# Altium schematic sheet Sensor Suite 1.SchDoc
size A4; SheetNumber: 4; SheetTotal: 6
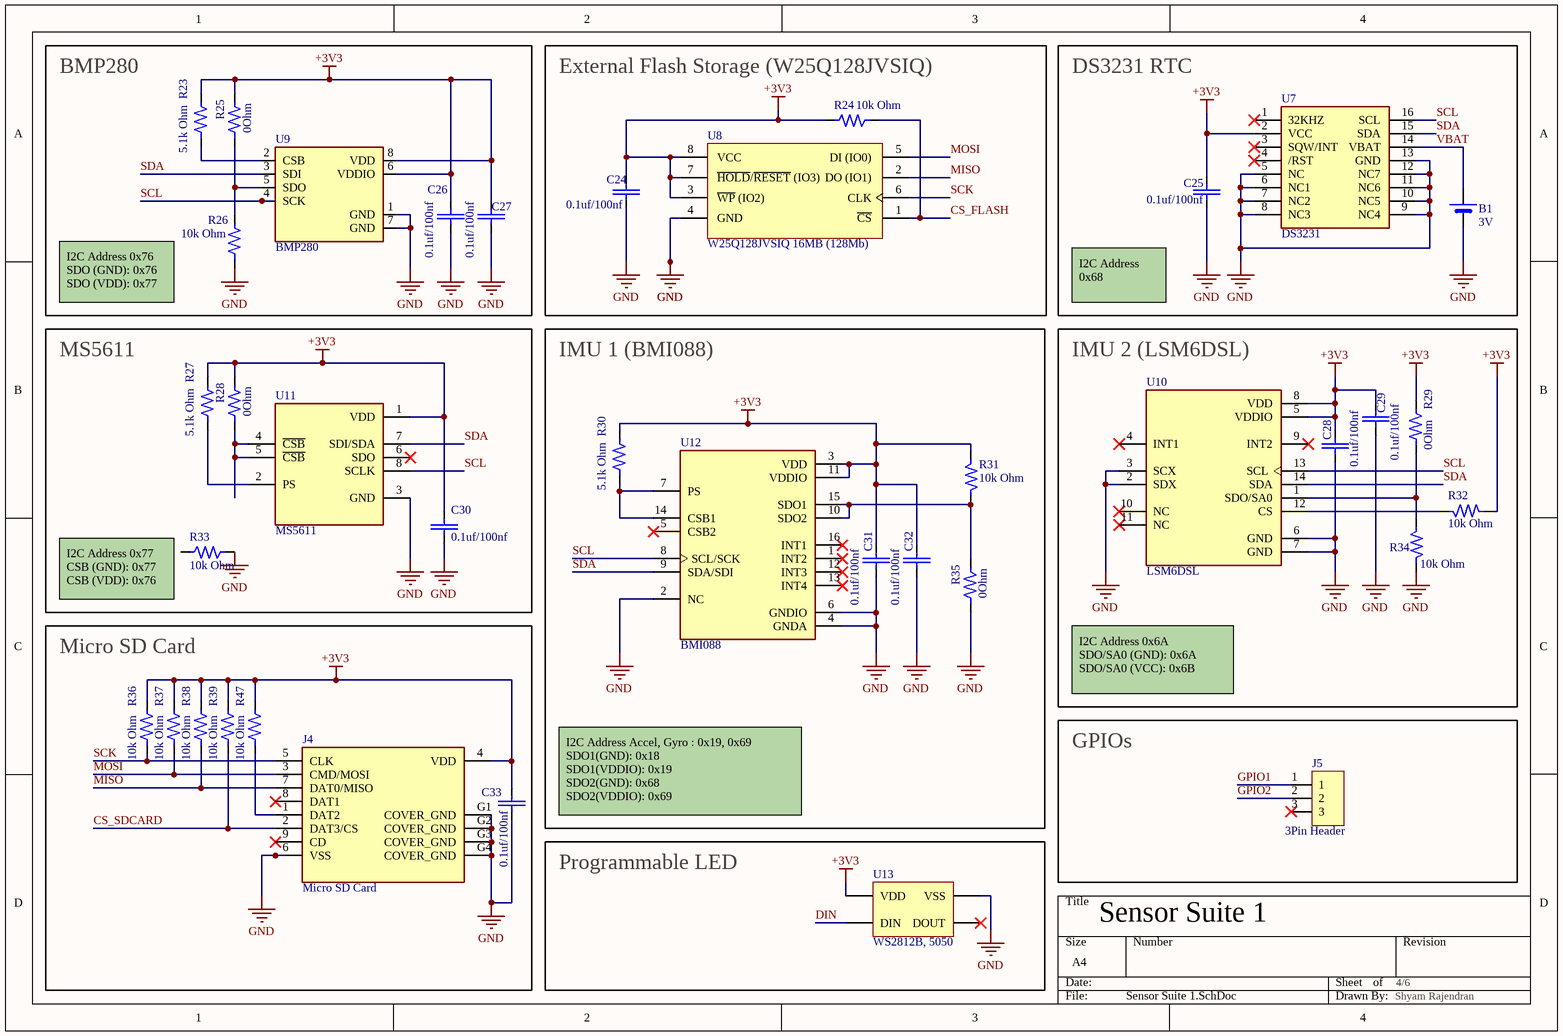
[diagram p0: Sensor Suite 1.SchDoc]

## Parts
B1  3V  [Battery Holder]
C24  0.1uf/100nf  [0.1uF Capacitor]
C25  0.1uf/100nf  [0.1uF Capacitor]
C26  0.1uf/100nf  [0.1uF Capacitor]
C27  0.1uf/100nf  [0.1uF Capacitor]
C28  0.1uf/100nf  [0.1uF Capacitor]
C29  0.1uf/100nf  [0.1uF Capacitor]
C30  0.1uf/100nf  [0.1uF Capacitor]
C31  0.1uf/100nf  [0.1uF Capacitor]
C32  0.1uf/100nf  [0.1uF Capacitor]
C33  0.1uf/100nf  [0.1uF Capacitor]
J4  Micro SD Card  [Micro SD Card]
J5  3Pin Header  [3 Pin Header]
R23  5.1k Ohm  [RESC2012X60N]
R24  10k Ohm  [RESC2013X60X35ML10T20]
R25  0Ohm  [1k 0805 Resistor]
R26  10k Ohm  [RESC2013X60X35ML10T20]
R27  5.1k Ohm  [RESC2012X60N]
R28  0Ohm  [1k 0805 Resistor]
R29  0Ohm  [1k 0805 Resistor]
R30  5.1k Ohm  [RESC2012X60N]
R31  10k Ohm  [RESC2013X60X35ML10T20]
R32  10k Ohm  [RESC2013X60X35ML10T20]
R33  10k Ohm  [RESC2013X60X35ML10T20]
R34  10k Ohm  [RESC2013X60X35ML10T20]
R35  0Ohm  [1k 0805 Resistor]
R36  10k Ohm  [RESC2013X60X35ML10T20]
R37  10k Ohm  [RESC2013X60X35ML10T20]
R38  10k Ohm  [RESC2013X60X35ML10T20]
R39  10k Ohm  [RESC2013X60X35ML10T20]
R47  10k Ohm  [RESC2013X60X35ML10T20]
U7  DS3231 RTC  [DS3231]  (value not drawn)
U8  W25Q128JVSIQ 16MB (128Mb)  [W25Q128JVSIQ]
U9  BMP280  [BMP280]
U10  LSM6DSL  [LSM6DSO32TR]
U11  MS5611  [MS561101BA03-50]
U12  BMI088  [BMI088]
U13  WS2812B, 5050  [WS2812B]

## Blocks framed on the sheet
BMP280: C26 C27 R23 R25 R26 U9
External Flash Storage (W25Q128JVSIQ): C24 R24 U8
DS3231 RTC: B1 C25 U7
MS5611: C30 R27 R28 R33 U11
IMU 1 (BMI088): C31 C32 R30 R31 R35 U12
IMU 2 (LSM6DSL): C28 C29 R29 R32 R34 U10
Micro SD Card: C33 J4 R36-R39 R47
GPIOs: J5
Programmable LED: U13

## Nets
+3V3: C24.1 C25.1 C26.2 C27.2 C28.2 C29.2 C30.2 C31.2 C32.2 C33.2 J4.4(VDD) R23.2 R24.2 R25.2 R27.2 R28.2 R29.2 R30.2 R31.2 R32.1 R36.2 R37.2 R38.2 R39.2 R47.2 U7.2(VCC) U8.3(~{WP}_(IO2)) U8.7(~{HOLD}/~{RESET}_(IO3)) U8.8(VCC) U9.6(VDDIO) U9.8(VDD) U10.5(VDDIO) U10.8(VDD) U11.1(VDD) U12.3(VDD) U12.11(VDDIO) U13.VDD
GND: B1.N C24.2 C25.2 C26.1 C27.1 C28.1 C29.1 C30.1 C31.1 C32.1 C33.1 J4.6(VSS) J4.G1(COVER_GND) J4.G2(COVER_GND) J4.G3(COVER_GND) J4.G4(COVER_GND) R26.1 R33.1 R34.1 R35.1 U7.5(NC) U7.6(NC1) U7.7(NC2) U7.8(NC3) U7.9(NC4) U7.10(NC5) U7.11(NC6) U7.12(NC7) U7.13(GND) U8.4(GND) U9.1(GND) U9.7(GND) U10.2(SDX) U10.3(SCX) U10.6(GND) U10.7(GND) U11.3(GND) U12.2(NC) U12.4(GNDA) U12.6(GNDIO) U13.VSS
CS_FLASH: R24.1 U8.1(~{CS})
CS_SDCARD: J4.2(DAT3/CS) R39.1
DIN: U13.DIN
GPIO1: J5.1
GPIO2: J5.2
MISO: J4.7(DAT0/MISO) R38.1 U8.2(DO_(IO1))
MOSI: J4.3(CMD/MOSI) R37.1 U8.5(DI_(IO0))
SCK: J4.5(CLK) R36.1 U8.6(CLK)
SCL: U7.16(SCL) U9.4(SCK) U10.13(SCL) U11.8(SCLK) U12.8(SCL/SCK)
SDA: U7.15(SDA) U9.3(SDI) U10.14(SDA) U11.7(SDI/SDA) U12.9(SDA/SDI)
VBAT: B1.P U7.14(VBAT)
NetJ4_1: J4.1(DAT2) R47.1
NetR23_1: R23.1 U9.2(CSB)
NetR25_1: R25.1 R26.2 U9.5(SDO)
NetR27_1: R27.1 U11.2(PS)
NetR28_1: R28.1 U11.4(~{CSB}) U11.5(~{CSB})
NetR29_1: R29.1 R34.2 U10.1(SDO/SA0)
NetR30_1: R30.1 U12.7(PS) U12.14(CSB1)
NetR31_1: R31.1 R35.2 U12.10(SDO2) U12.15(SDO1)
NetR32_2: R32.2 U10.12(CS)

Not connected (* = marked no-connect by the designer): J4 8(DAT1)* 9(CD)*; J5 3*; R33 2; U7 1(32KHZ)* 3(SQW/INT)* 4(/RST)*; U10 4(INT1)* 9(INT2)* 10(NC)* 11(NC)*; U11 6(SDO)*; U12 1(INT2)* 5(CSB2)* 12(INT3)* 13(INT4)* 16(INT1)*; U13 DOUT*

## Notes on the sheet
- I2C Address 0x76
  SDO (GND): 0x76
  SDO (VDD): 0x77
- I2C Address 0x68
- (near R33) I2C Address 0x77
  CSB (GND): 0x77
  CSB (VDD): 0x76
- I2C Address 0x6A
  SDO/SA0 (GND): 0x6A
  SDO/SA0 (VCC): 0x6B
- (near C33) I2C Address Accel, Gyro : 0x19, 0x69
  SDO1(GND): 0x18
  SDO1(VDDIO): 0x19
  SDO2(GND): 0x68
  SDO2(VDDIO): 0x69
- Sensor Suite 1 <BMP280>
- 4/6 <BMP280>
- Shyam Rajendran <BMP280>

## Library data of the parts
B1 = Button Cell: CR2032 Button Cell
C24-C33 = CC0805KRX7R9BB104: 0.1 uF, Multilayer Ceramic Capacitor, 50 V, ï¿½ 10%, X7R, 0805 [2012 Metric]; Manufacturer: Yageo; Value: 100nF; Voltage Rating: 50V; Insulation Resistance: 100GR; Supplier: Future Electronics; Supplier Part Number: 2986263; Manufacturer Part Number: CC0805KRX7R9BB104; RoHS: Yes; Category: Ceramic Capacitors; Stock: 2884000; Pricing: 4000=0.009, 12000=0.0088, 40000=0.0085, 80000=0.0083, 160000=0.008 (USD); Mounting Technology: Surface Mount; Case/Package: 0805; Pins: 2; Case Code (Metric): 2012; Case Code (Imperial): 0805; Material: Ceramic; Min Operating Temperature: -55°C; Max Operating Temperature: 125°C; Packaging: Tape and Reel; Tolerance: 10%; Dielectric: X7R; Series: CC; Package Quantity: 4000; Voltage: 50V; Termination: SMD/SMT; Length: 2mm; Height: 0.85mm; Depth: 1.25mm; Radiation Hardening: No; RoHS Compliant: Yes; Lead Free: 5697LeadFree; Reach SVHC Compliant: No; Halogen Free: 5694HalogenFree
J4 = Micro SD Card: Micro SD Card Connector, 9 Positions, Connector and Ejector, Push In, Auto Eject Out, Surface Mount, 1.8 mm Height Above Board, Gold Flash; MF: CUI Devices; MP: MSD-1-A; SnapEDA_Link: https://www.snapeda.com/parts/MSD-1-A/CUI+Devices/view-part/?ref=snap; Package: None; Value: *; CUI_purchase_URL: https://www.cuidevices.com/product/interconnect/connectors/memory-card-connectors/sd-card-connectors/msd-1-a?utm_source=snapeda.com&utm_medium=referral&utm_campaign=snapedaBOM; Check_prices: https://www.snapeda.com/parts/MSD-1-A/CUI+Devices/view-part/?ref=eda
J5 = Header 3pin
R23 R27 R30 = RC0805FR-075K1L: 5.1k Ohm, 0805, 0.125W, 150V, 1% +/-Tol, 100ppm/Cel, Surface Mount; Manufacturer: Yageo; Additional Feature: LASER TRIMMABLE; Power: 125mW; Rated Temperature: 70°C; Value: 5.1kR; Temperature Coefficient (ppm/Cel): 100; Package Height: 0.5mm; Package Length: 2mm; Package Width: 1.25mm; Supplier: Future Electronics; Supplier Part Number: 5647425; Manufacturer Part Number: RC0805FR-075K1L; RoHS: Yes; Category: Chip SMD Resistors; Stock: 15000; Pricing: 5000=0.0021, 20000=0.002, 100000=0.0019, 200000=0.0018, 625000=0.0017 (USD); Mounting Technology: Surface Mount; Pins: 2; Package Shape: Rectangular; Case/Package: 0805; Terminal Finish: Nickel; Min Operating Temperature: -55°C; Max Operating Temperature: 155°C; Tolerance: 1%; JESD-609 Code: e3; Termination: Wraparound; Resistor Type: FIXED RESISTOR; Construction: Chip; Packaging: Tape and Reel; Technology: METAL GLAZE/THICK FILM; Working Voltage: 150V; Reach SVHC Compliant: Yes; RoHS Compliant: Yes; ComponentLink1URL: https://datasheet.ciiva.com:443/pdfs/VipMasterIC/IC/YAGO/YAGO-S-A0008145938/YAGO-S-A0008145938-1.pdf?src-supplier=IHS+Markit; ComponentLink1Description: https://datasheet.ciiva.com:443/pdfs/VipMasterIC/IC/YAGO/YAGO-S-A0008145938/YAGO-S-A0008145938-1.pdf?src-supplier=IHS+Markit; ComponentLink2URL: https://datasheet.ciiva.com/11808/0900766b8106beab-11808171.pdf?src-supplier=Rs; ComponentLink2Description: https://datasheet.ciiva.com/11808/0900766b8106beab-11808171.pdf?src-supplier=Rs; ComponentLink3URL: https://datasheet.ciiva.com/2456/pyu-r-int-thick-7-2456979.pdf?src-supplier=Digikey; ComponentLink3Description: https://datasheet.ciiva.com/2456/pyu-r-int-thick-7-2456979.pdf?src-supplier=Digikey; ComponentLink4URL: https://datasheet.ciiva.com/2456/pyu-r-int-thick-7-2456980.pdf?src-supplier=Digikey; ComponentLink4Description: https://datasheet.ciiva.com/2456/pyu-r-int-thick-7-2456980.pdf?src-supplier=Digikey; ComponentLink5URL: https://datasheet.ciiva.com/15189/getdatasheetpartid-326574-15189996.pdf?src-supplier=Verical; ComponentLink5Description: https://datasheet.ciiva.com/15189/getdatasheetpartid-326574-15189996.pdf?src-supplier=Verical; ComponentLink6URL: https://datasheet.ciiva.com/2456/pyu-r-int-thick-7-2456978.pdf?src-supplier=Digikey; ComponentLink6Description: https://datasheet.ciiva.com/2456/pyu-r-int-thick-7-2456978.pdf?src-supplier=Digikey
R24 R26 R31-R34 R36-R39 R47 = RC0805FR-0710KL: 10 kOhm, SMD Chip Resistor, ï¿½ 1%, 125 mW, 0805 [2012 Metric], Thick Film, General Purpose; Manufacturer: Yageo; Value: 10kR; Power Rating: 125mW; Voltage Rating: 150V; Temperature Coefficient: 100ppm/°C; Supplier: Future Electronics; Supplier Part Number: 3310877; Manufacturer Part Number: RC0805FR-0710KL; RoHS: Yes; Category: Chip SMD Resistors; Stock: 15945000; Pricing: 5000=0.0021, 20000=0.002, 100000=0.0019, 200000=0.0018, 625000=0.0017 (USD); Case/Package: 0805; Case Code (Imperial): 0805; Case Code (Metric): 2012; Min Operating Temperature: -55°C; Max Operating Temperature: 155°C; Packaging: Tape and Reel; Tolerance: 1%; Termination: SMD/SMT; Number of Terminations: 2; Max Power Dissipation: 125mW; Features: Moisture Resistant; Series: RC; Resistor Type: Thick Film; Construction: Rectangular; Resistance Tolerance: 1%; Package Quantity: 1; Technology: THICK FILM; Voltage Rating (AC): 150V; Length: 0.079inch; Width: 0.049inch; Height: 0.024inch; Depth: 1.25mm; Lead Free: Lead Free; RoHS Compliant: Yes; Military Standard: Not; Reach SVHC Compliant: Unknown; ComponentLink1URL: https://datasheet.ciiva.com/11808/0900766b8106beab-11808151.pdf?src-supplier=Rs; ComponentLink1Description: https://datasheet.ciiva.com/11808/0900766b8106beab-11808151.pdf?src-supplier=Rs; ComponentLink2URL: https://datasheet.ciiva.com/46447/444164-46447563.pdf?src-supplier=Element14; ComponentLink2Description: https://datasheet.ciiva.com/46447/444164-46447563.pdf?src-supplier=Element14; ComponentLink3URL: https://datasheet.ciiva.com/2456/pyu-r-int-thick-7-2456973.pdf?src-supplier=Digikey; ComponentLink3Description: https://datasheet.ciiva.com/2456/pyu-r-int-thick-7-2456973.pdf?src-supplier=Digikey; ComponentLink4URL: https://datasheet.ciiva.com/2456/pyu-r-int-thick-7-2456974.pdf?src-supplier=Digikey; ComponentLink4Description: https://datasheet.ciiva.com/2456/pyu-r-int-thick-7-2456974.pdf?src-supplier=Digikey; ComponentLink5URL: https://datasheet.ciiva.com/2456/pyu-r-int-thick-7-2456972.pdf?src-supplier=Digikey; ComponentLink5Description: https://datasheet.ciiva.com/2456/pyu-r-int-thick-7-2456972.pdf?src-supplier=Digikey; ComponentLink6URL: https://datasheet.ciiva.com/12669/rc0805-12669688.pdf?src-supplier=Mouser; ComponentLink6Description: https://datasheet.ciiva.com/12669/rc0805-12669688.pdf?src-supplier=Mouser; ComponentLink7URL: https://datasheet.ciiva.com/16747/rc0805-16747087.pdf?src-supplier=Future+Electronics; ComponentLink7Description: https://datasheet.ciiva.com/16747/rc0805-16747087.pdf?src-supplier=Future+Electronics
R25 R28 R29 R35 = CRCW08050000Z0EA: 0 Ohm Resistor, Jumper, 0805 [2012 Metric], Thick Film, 125 mW, Surface Mount; Manufacturer: Vishay; Value: 0mR; Power Rating: 125mW; Temperature Coefficient: 100ppm/°C; Voltage Rating: 150V; Tolerance: 1%; Supplier: Arrow Electronics; Supplier Part Number: CRCW08050000Z0EA; Manufacturer Part Number: CRCW08050000Z0EA; RoHS: Yes; Category: Chip SMD Resistors; Stock: 1390000; Pricing: 5000=0.0051, 10000=0.005, 15000=0.0049, 25000=0.0045 (USD); Case/Package: 0805; Case Code (Imperial): 0805; Case Code (Metric): 2012; Contact Plating: Tin; Weight: 0.000194oz; Min Operating Temperature: -55°C; Max Operating Temperature: 155°C; Packaging: Tape and Reel; Series: CRCW; Number of Terminations: 2; Resistor Type: Thick Film; Termination: SMD/SMT; Max Power Dissipation: 125mW; Package Quantity: 1; Features: Automotive AEC-Q200; Construction: Rectangular; Technology: THICK FILM; Voltage Rating (DC): 150V; Resistance Tolerance: 1%; Length: 2mm; Width: 0.049inch; Height: 0.45mm; Depth: 1.25mm; Radiation Hardening: No; RoHS Compliant: Yes; Military Standard: Not; Reach SVHC Compliant: Unknown; Lead Free: 5697LeadFree; ComponentLink1URL: https://datasheet.ciiva.com/11811/0900766b80d98b26-11811304.pdf?src-supplier=Rs; ComponentLink1Description: https://datasheet.ciiva.com/11811/0900766b80d98b26-11811304.pdf?src-supplier=Rs; ComponentLink2URL: https://datasheet.ciiva.com/7841/1720486-7841839.pdf?src-supplier=Element14; ComponentLink2Description: https://datasheet.ciiva.com/7841/1720486-7841839.pdf?src-supplier=Element14; ComponentLink3URL: https://datasheet.ciiva.com/26314/fld-crcw-e3-data-en-26314630.pdf?src-supplier=Distrelec; ComponentLink3Description: https://datasheet.ciiva.com/26314/fld-crcw-e3-data-en-26314630.pdf?src-supplier=Distrelec; ComponentLink4URL: https://datasheet.ciiva.com/7841/1697337-7841629.pdf?src-supplier=Element14; ComponentLink4Description: https://datasheet.ciiva.com/7841/1697337-7841629.pdf?src-supplier=Element14; ComponentLink5URL: https://datasheet.ciiva.com/2463/dcrcwe3-2463038.pdf?src-supplier=Digikey; ComponentLink5Description: https://datasheet.ciiva.com/2463/dcrcwe3-2463038.pdf?src-supplier=Digikey; ComponentLink6URL: https://datasheet.ciiva.com/2463/dcrcwe3-2463039.pdf?src-supplier=Digikey; ComponentLink6Description: https://datasheet.ciiva.com/2463/dcrcwe3-2463039.pdf?src-supplier=Digikey; ComponentLink7URL: https://datasheet.ciiva.com/2463/dcrcwe3-2463037.pdf?src-supplier=Digikey; ComponentLink7Description: https://datasheet.ciiva.com/2463/dcrcwe3-2463037.pdf?src-supplier=Digikey; ComponentLink8URL: https://datasheet.ciiva.com/16719/70201119-16719706.pdf?src-supplier=Allied+Electronics; ComponentLink8Description: https://datasheet.ciiva.com/16719/70201119-16719706.pdf?src-supplier=Allied+Electronics; ComponentLink9URL: https://datasheet.ciiva.com/5543/dcrcwe3-109170-5543096.pdf?src-supplier=Mouser; ComponentLink9Description: https://datasheet.ciiva.com/5543/dcrcwe3-109170-5543096.pdf?src-supplier=Mouser; ComponentLink10URL: https://datasheet.ciiva.com/16389/dcrcwe3-16389338.pdf?src-supplier=Future+Electronics; ComponentLink10Description: https://datasheet.ciiva.com/16389/dcrcwe3-16389338.pdf?src-supplier=Future+Electronics
U7 = DS3231: Real Time Clock (RTC) IC Clock/Calendar - IÂ²C, 2-Wire Serial 8-SOIC (0.154, 3.90mm Width); MF: Maxim Integrated; Check_prices: https://www.snapeda.com/parts/DS3231/Maxim+Integrated/view-part/?ref=eda; Value: *; Availability: In Stock; MP: DS3231; Price: None; Package: SOIC-16 Maxim Integrated; SnapEDA_Link: https://www.snapeda.com/parts/DS3231/Maxim+Integrated/view-part/?ref=snap; Purchase-URL: https://pricing.snapeda.com/search/part/DS3231/?ref=eda
U8 = W25Q128JVSIQ TR: 16MB (128Mb) Flash, PDSO8; Manufacturer: Winbond; Package Body Material: Plastic; Clock Frequency: 133MHz; Density: 134217728b; Memory Width: 8; Channels: 1; Memory Size: 16777216; Number of Words Code: 16M; Operating Mode: SYNCHRONOUS; Organization: 16MX8; Parallel/Serial: SERIAL; Programming Voltage: 3V; Max Supply Voltage: 3.6V; Min Supply Voltage: 2.7V; Supplier: Digikey; Supplier Part Number: W25Q128JVSIQCT-ND; Manufacturer Part Number: W25Q128JVSIQ TR; RoHS: Yes; Category: Flash; Stock: 210919; Pricing: 1=1.57, 10=1.472, 25=1.4304, 50=1.3988, 100=1.3668, 250=1.32448, 500=1.2926, 1000=1.26092, 2000=1.22957, 4000=1.19866, 6000=1.18081 (USD); Case/Package: SOP; Pins: 8; Package Shape: Square; Min Operating Temperature: -40°C; Max Operating Temperature: 85°C; Memory Format: FLASH; Type: NOR TYPE; JESD-30 Code: S-PDSO-G8; Package Style: SMALL OUTLINEMeter; Nominal Supply Voltage: 3V; Surface Mount: Yes; Technology: CMOS; Terminal Form: Gull Wing; Terminal Position: DUAL; Length: 5.23mm; Width: 5.23mm; Height - Seated (Max): 2.16mm; Terminal Pitch: 1.27mm; Temperature Grade: INDUSTRIAL; Reach SVHC Compliant: Yes; RoHS Compliant: Yes; ComponentLink1URL: https://datasheet.ciiva.com:443/pdfs/VipMasterIC/IC/WBND/WBND-S-A0002933800/WBND-S-A0002933800-1.pdf?src-supplier=IHS+Markit; ComponentLink1Description: https://datasheet.ciiva.com:443/pdfs/VipMasterIC/IC/WBND/WBND-S-A0002933800/WBND-S-A0002933800-1.pdf?src-supplier=IHS+Markit; ComponentLink2URL: http://www.winbond.com/resource-files/w25q128jv%20revf%2003272018%20plus.pdf?src-supplier=Digikey; ComponentLink2Description: http://www.winbond.com/resource-files/w25q128jv%20revf%2003272018%20plus.pdf?src-supplier=Digikey; ComponentLink3URL: http://www.winbond.com/resource-files/w25q128jv%20spi%20revc%2011162016.pdf?src-supplier=Digikey; ComponentLink3Description: http://www.winbond.com/resource-files/w25q128jv%20spi%20revc%2011162016.pdf?src-supplier=Digikey
U9 = BMP280: BMP280 Absolute Barometric Pressure Sensor for Battery Powered Devices 2 x 2.5mm; Package: None; Availability: Unavailable; MP: BMP280; Value: *; Price: None
U10 = LSM6DSL: Accelerometer, Gyroscope, Temperature, 6 Axis Sensor IÂ²C, SPI Output; MF: STMicroelectronics; SnapEDA_Link: https://www.snapeda.com/parts/LSM6DSO32TR/STMicroelectronics/view-part/?ref=snap; Package: VFLGA-14 STMicroelectronics; Value: *; MP: LSM6DSO32TR; Check_prices: https://www.snapeda.com/parts/LSM6DSO32TR/STMicroelectronics/view-part/?ref=eda
U11 = MS561101BA03-50: Sensor;MS5611-BT M-CAPS 3X5X1MM T&R;Pressure;MS561101BA03-50 | TE Connectivity MS561101BA03-50; SnapEDA_Link: https://www.snapeda.com/parts/MS561101BA03-50/TE+Connectivity+ALCOSWITCH+Switches/view-part/?ref=snap; Package: SMD-8 Measurement Specialties; Value: *; MF: TE Connectivity; MP: MS561101BA03-50; Check_prices: https://www.snapeda.com/parts/MS561101BA03-50/TE+Connectivity+ALCOSWITCH+Switches/view-part/?ref=eda
U12 = BMI088: High-performance 6-axis inertial sensor (accelerometer + gyroscope) <a href="https://pricing.snapeda.com/parts/BMI088/Bosch%20Sensortec/view-part?ref=eda">Check prices</a>; Package: None; MP: BMI088; Value: *; Availability: Unavailable; Price: None
U13 = WS2812B: Intelligent Control LED Integrated Light Source, 3.5 to 5.3 V, -25 to 80 degC, 4-Pin SMD, RoHS, Tape and Reel; Manufacturer: Adafruit-Industries-LLC; Number of LEDs: 10; Configuration: Discrete; Utilized LED: WS2812(5050); Datasheet URL: http://datasheet.octopart.com/ADA1655-Adafruit-Industries-datasheet-32028139.pdf; Series: Neopixel; Interface: -; Package Description: 4-Pin Surface Mount Device, Body 5 x 5 mm; Color: Red,Green,Blue(RGB); Category: Optoelectronics; Controller Type: -; Package Reference: 1655; Manufacturer URL: https://www.adafruit.com/; Mounting Type: SurfaceMount; Datasheet Version: May-13; Size / Dimension: 5.00mmLx5.00mmW; Family: Addressable,Specialty